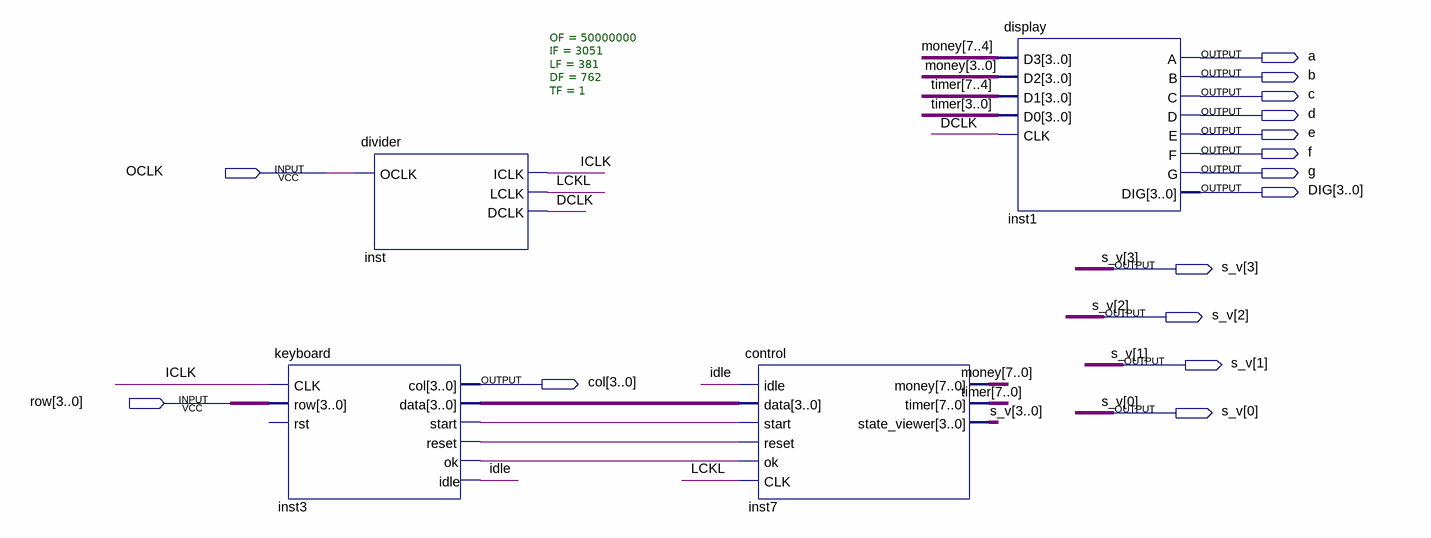
[diagram p0: schematic sheet]
// Quartus schematic coin_charger.bdf as structural Verilog: 4 symbols, 15 pins
module coin_charger (
  input  OCLK,
  input  [3:0] row,
  output a,
  output b,
  output c,
  output d,
  output e,
  output f,
  output g,
  output [3:0] DIG,
  output [3:0] s_v,
  output [3:0] col
);

  wire DCLK, ICLK, idle, inst3_ok, inst3_reset, inst3_start, LCKL;
  wire [3:0] inst3_data;
  wire [7:0] money, timer;

  keyboard inst3 (
    .CLK(ICLK), .row(row), .col(col), .data(inst3_data), .start(inst3_start), .reset(inst3_reset),
    .ok(inst3_ok), .idle(idle));  // open: rst
  divider #(.OF(50000000), .IF(3051), .LF(381), .DF(762), .TF(1)) inst (
    .OCLK(OCLK), .ICLK(ICLK), .LCLK(LCKL), .DCLK(DCLK));
  control inst7 (
    .idle(idle), .data(inst3_data), .start(inst3_start), .reset(inst3_reset), .ok(inst3_ok), .CLK(LCKL),
    .money(money), .timer(timer), .state_viewer(s_v));
  display inst1 (
    .D3(money[7:4]), .D2(money[3:0]), .D1(timer[7:4]), .D0(timer[3:0]), .CLK(DCLK), .A(a), .B(b), .C(c),
    .D(d), .E(e), .F(f), .G(g), .DIG(DIG));
endmodule
